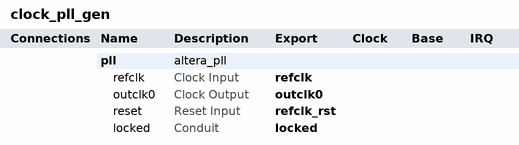
[diagram p0: system contents]
# Platform Designer (Qsys) system clock_pll_gen, Cyclone V 5CSXFC6D6F31C6
# Parameters at their usual value, and those the tool derives, are not listed.
package require -exact qsys 25.1
create_system clock_pll_gen
set_project_property DEVICE_FAMILY {Cyclone V}
set_project_property DEVICE 5CSXFC6D6F31C6

add_instance pll altera_pll 25.1
set_instance_parameter_value pll gui_device_speed_grade 1
set_instance_parameter_value pll gui_number_of_clocks 1
set_instance_parameter_value pll gui_operation_mode direct
set_instance_parameter_value pll gui_output_clock_frequency0 28.672
set_instance_parameter_value pll gui_pll_mode {Fractional-N PLL}
set_instance_parameter_value pll gui_reference_clock_frequency 50.0
set_instance_parameter_value pll gui_use_locked true

# exported interfaces
add_interface locked conduit end
set_interface_property locked EXPORT_OF pll.locked
add_interface outclk0 clock source
set_interface_property outclk0 EXPORT_OF pll.outclk0
add_interface refclk clock sink
set_interface_property refclk EXPORT_OF pll.refclk
add_interface refclk_rst reset sink
set_interface_property refclk_rst EXPORT_OF pll.reset

set_interconnect_requirement {$system} qsys_mm.clockCrossingAdapter HANDSHAKE
set_interconnect_requirement {$system} qsys_mm.enableEccProtection FALSE
set_interconnect_requirement {$system} qsys_mm.insertDefaultSlave FALSE
set_interconnect_requirement {$system} qsys_mm.maxAdditionalLatency 1

save_system clock_pll_gen.qsys
